# EAGLE schematic Gameboy Cartridge (EAGLE 8.0.0)
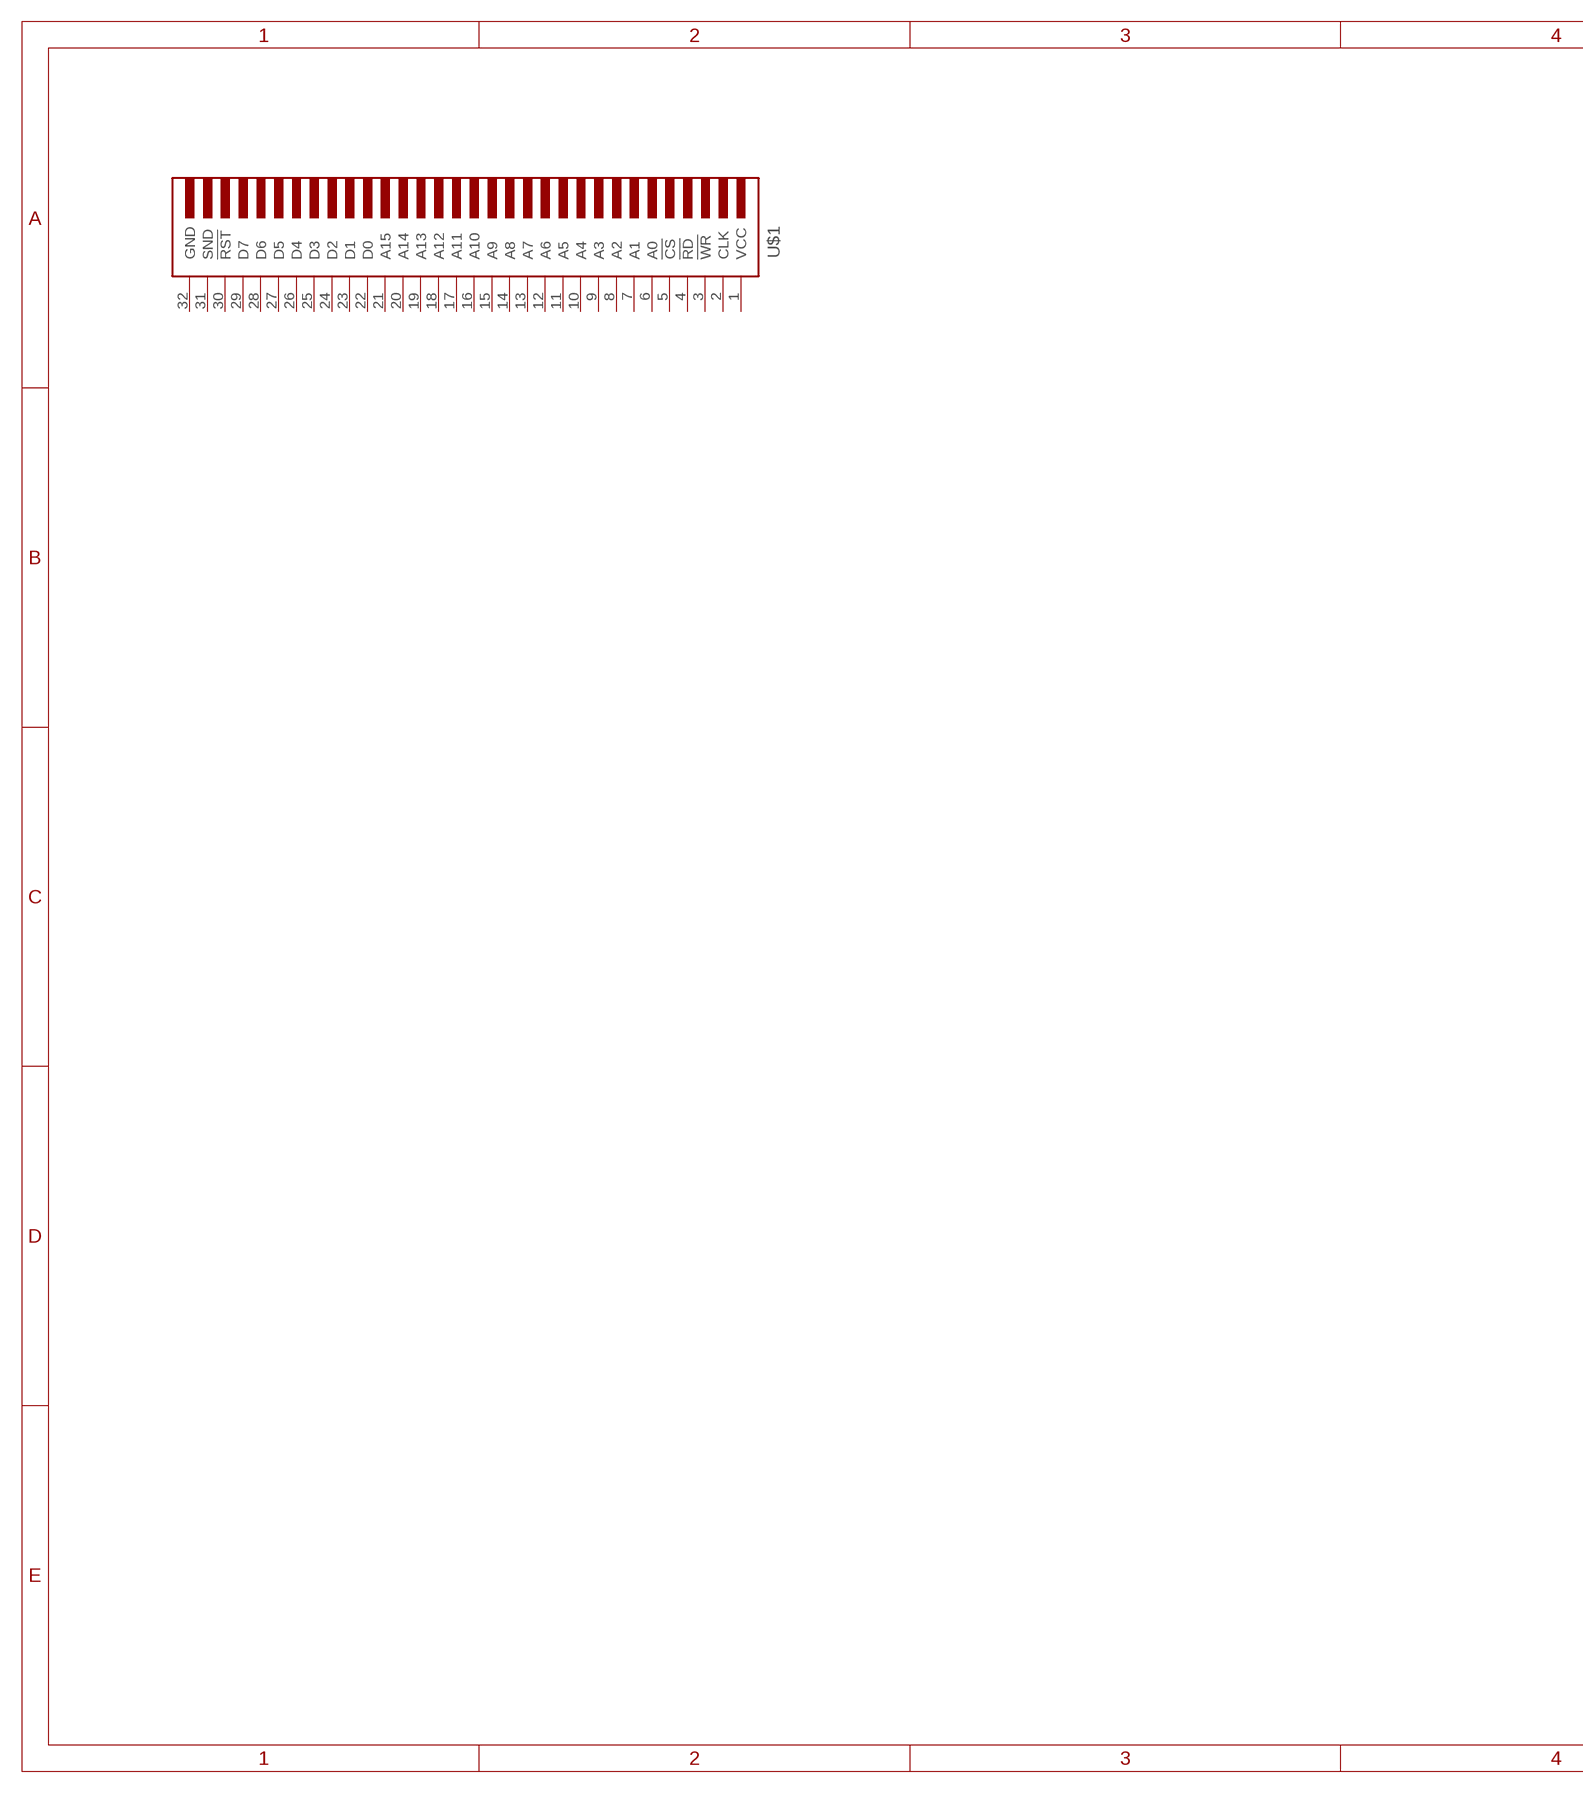
[diagram p0: schematic, sheet 1, part 1 of 2]
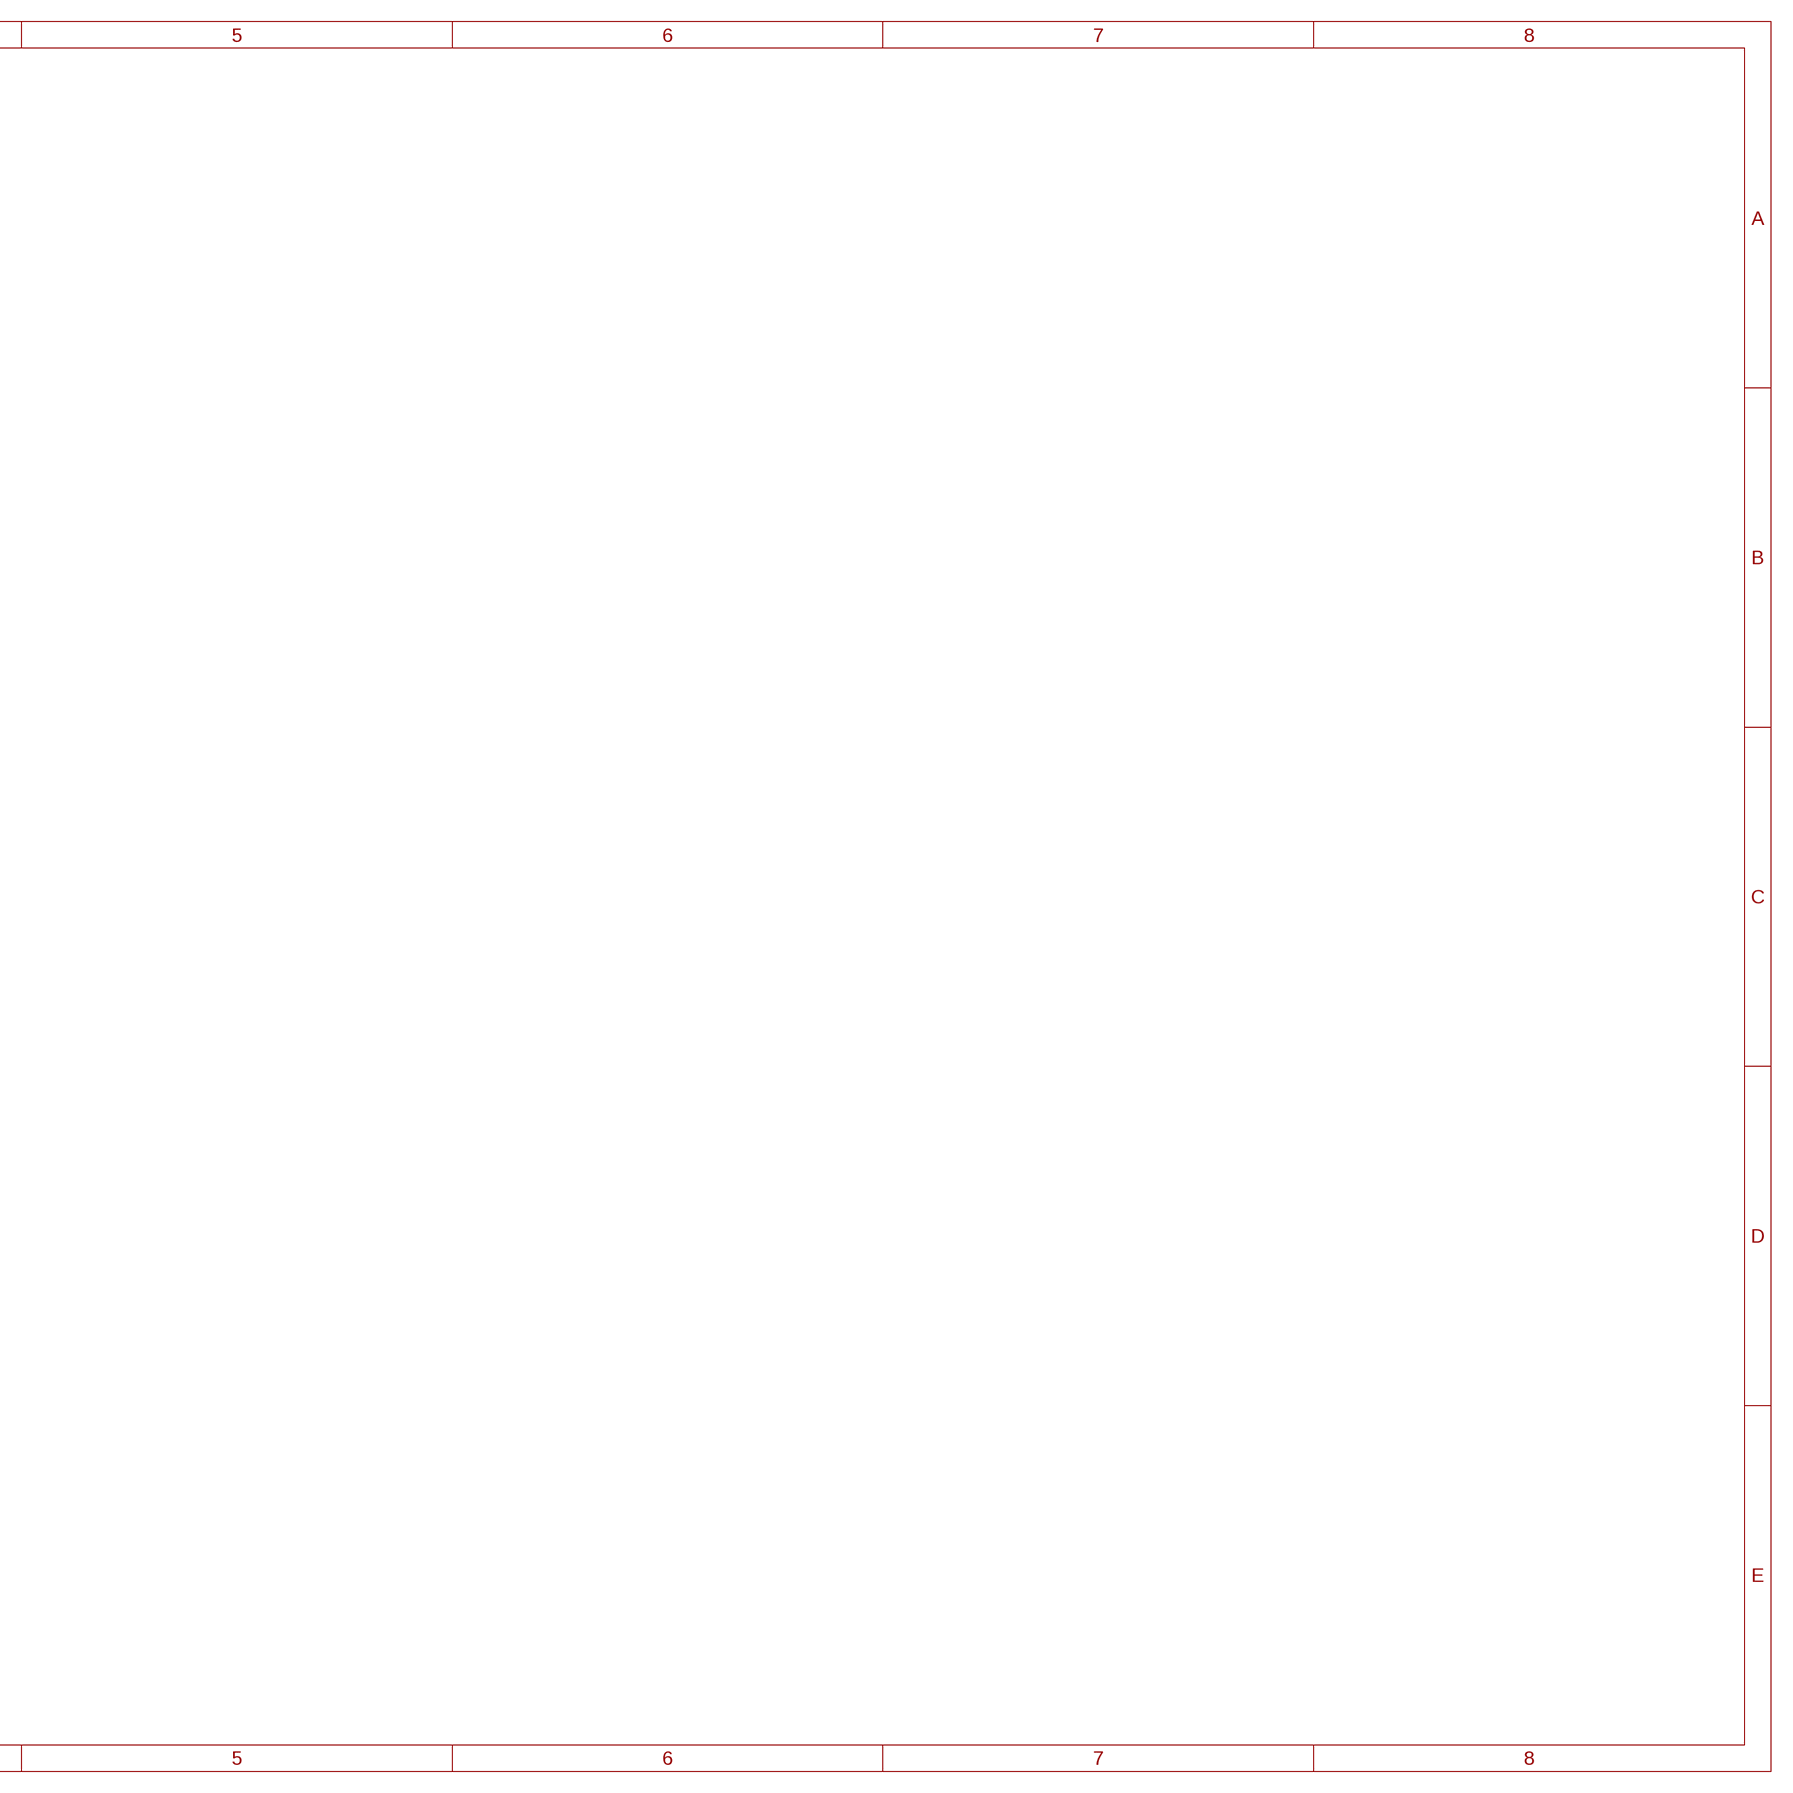
[diagram p1: schematic, sheet 1, part 2 of 2]

## Parts
U$1  GBCART-FULL  [GBCART]
Unconnected: U$1.2(CLK) U$1.3(!WR) U$1.4(!RD) U$1.5(!CS) U$1.6(A0) U$1.7(A1) U$1.8(A2) U$1.9(A3) U$1.10(A4) U$1.11(A5) U$1.12(A6) U$1.13(A7) U$1.14(A8) U$1.15(A9) U$1.16(A10) U$1.17(A11) U$1.18(A12) U$1.19(A13) U$1.20(A14) U$1.21(A15) U$1.22(D0) U$1.23(D1) U$1.24(D2) U$1.25(D3) U$1.26(D4) U$1.27(D5) U$1.28(D6) U$1.29(D7) U$1.30(!RST) U$1.31(SND)

## Power pins joined to a net without a drawn wire
GND: U$1.32(GND)
VCC: U$1.1(VCC)

## Library data of the parts
U$1 = gameboy:GBCART